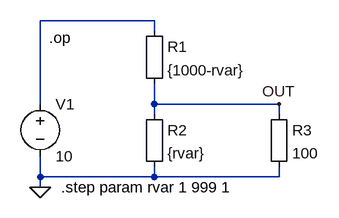
[diagram p0: schematic Rvar.asc]
Rvar.asc, the LTspice schematic file:
Version 4
SHEET 1 880 680
WIRE -32 208 -32 80
WIRE -32 320 -32 288
WIRE -32 336 -32 320
WIRE 144 80 -32 80
WIRE 144 96 144 80
WIRE 144 208 144 176
WIRE 144 224 144 208
WIRE 144 320 -32 320
WIRE 144 320 144 304
WIRE 336 208 144 208
WIRE 336 224 336 208
WIRE 336 320 144 320
WIRE 336 320 336 304
FLAG -32 336 0
FLAG 336 208 OUT
SYMBOL voltage -32 192 R0
WINDOW 123 0 0 Left 0
WINDOW 39 0 0 Left 0
SYMATTR InstName V1
SYMATTR Value 10
SYMBOL Misc\\EuropeanResistor 128 80 R0
SYMATTR InstName R1
SYMATTR Value {1000-rvar}
SYMBOL Misc\\EuropeanResistor 128 208 R0
SYMATTR InstName R2
SYMATTR Value {rvar}
SYMBOL Misc\\EuropeanResistor 320 208 R0
SYMATTR InstName R3
SYMATTR Value 100
TEXT 0 336 Left 0 !.step param rvar 1 999 1
TEXT -18 106 Left 0 !.op

The netlist it stands for:
* Rvar.asc
V1 N001 0 10
R1 N001 OUT {1000-rvar}
R2 OUT 0 {rvar}
R3 OUT 0 100
.step param rvar 1 999 1
.op
.backanno
.end